# Altium schematic sheet Flight_Controller1.SchDoc: Sensorless BLDC Controller
size A3; PageSetup: Record=PageOptions|CenterHorizontal=True|CenterVertical=True|PrintScale=0.34|XCorrection=1.00|YCorrection=1.00|PrintKind=1|BorderSize=5000000|LeftOffset=0|BottomOffset=0|Orientation=2|PaperLength=1000|PaperWidth=1000|Scale=100|PaperSource=7|PrintQuality=-3|MediaType=1|DitherType=10|PrintScaleMode=1|PaperKind=A3|PaperIndex=8
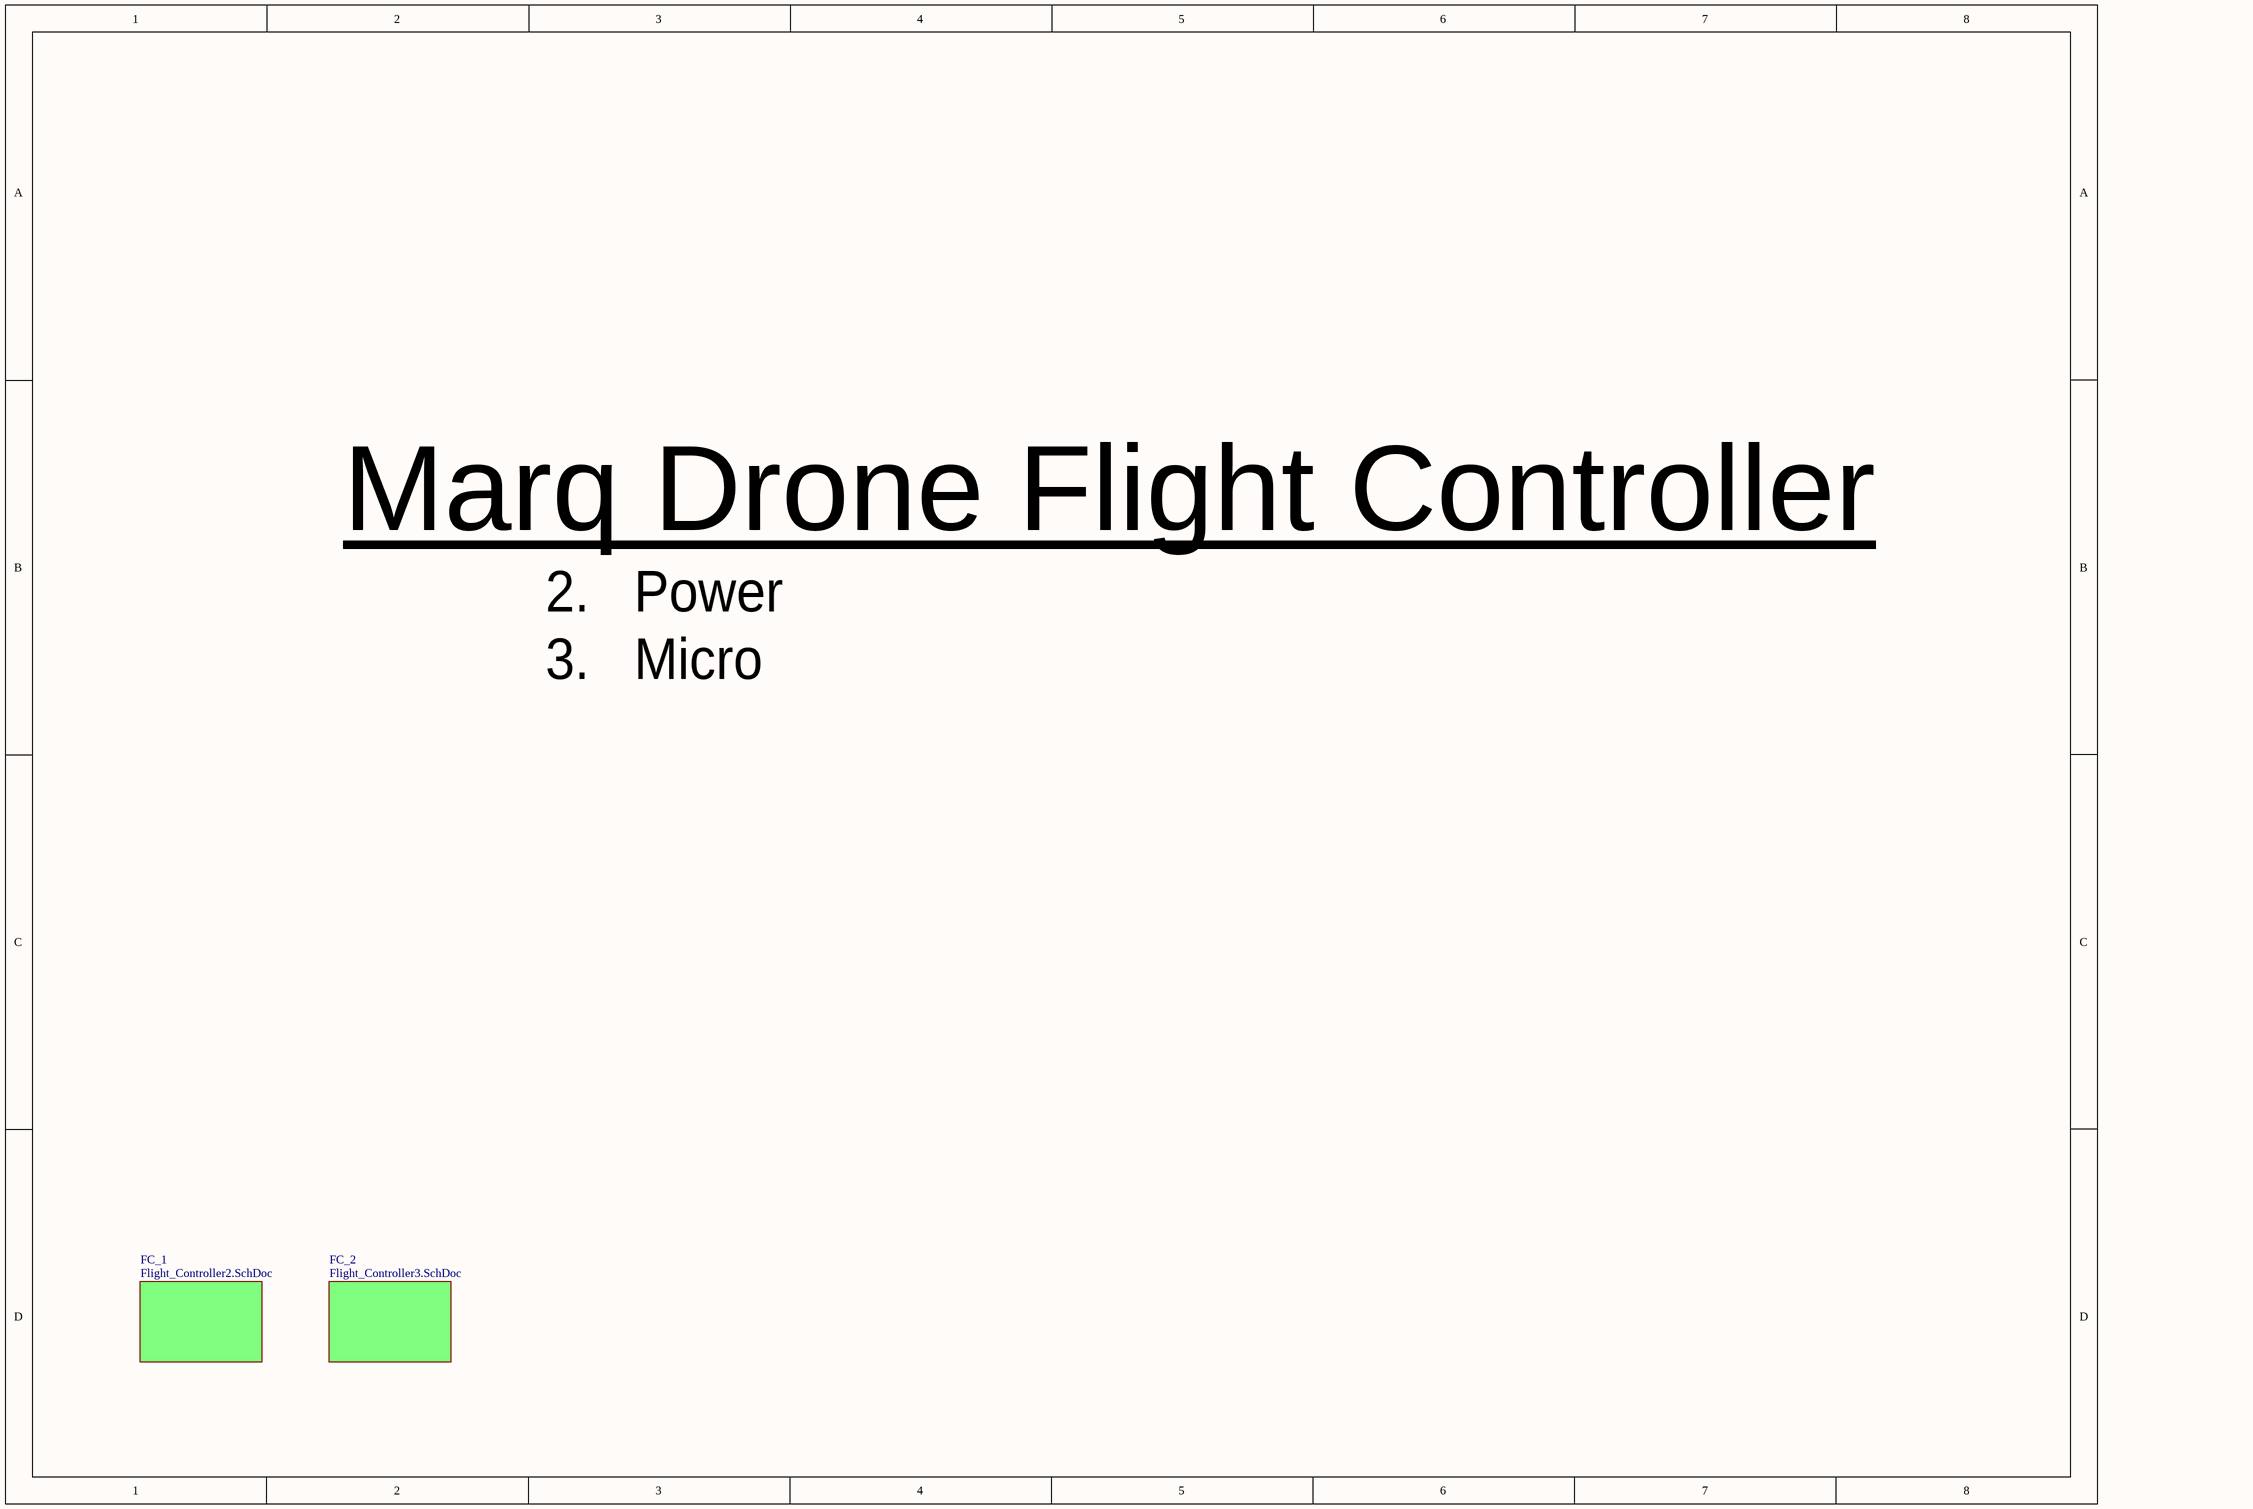
[diagram p0: Flight_Controller1.SchDoc]

## Sub-sheets
FC_1 = Flight_Controller2.SchDoc: no entries
FC_2 = Flight_Controller3.SchDoc: no entries

## Notes on the sheet
- Marq Drone Flight Controller
- 2.   Power
- 3.   Micro